# EAGLE schematic homecontroller_anschlussplan (EAGLE 6.6.0)
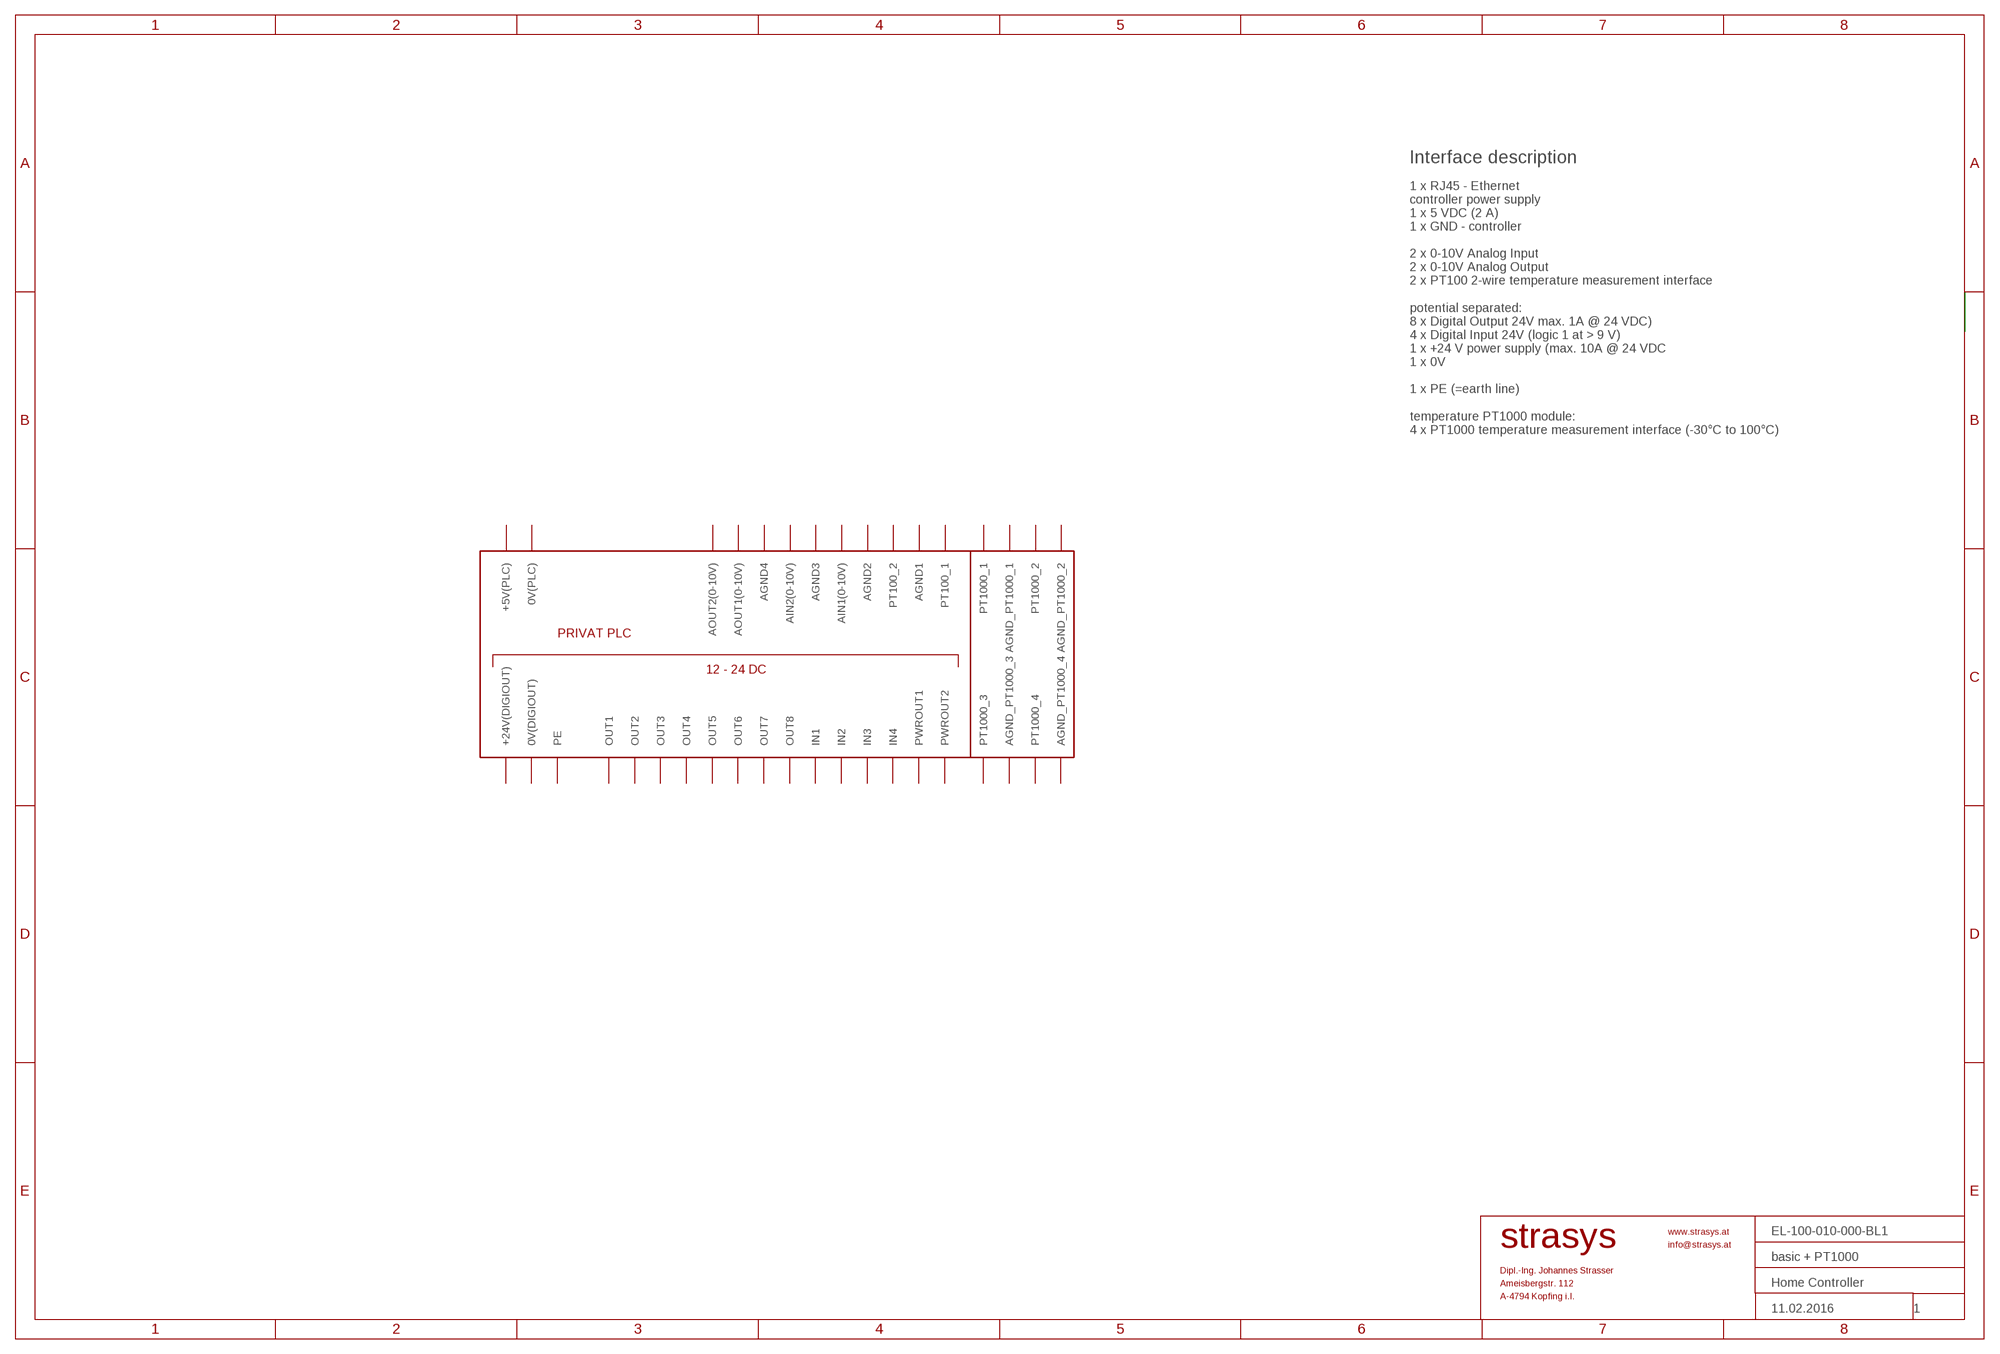
[diagram p0: schematic, sheet 1]
FRAME1 (A3L-LOC): DATE_DRAWING: 11.02.2016; DRAWING_NAME1: basic + PT1000; DRAWING_NAME2: Home Controller; DRAWING_NO: EL-100-010-000-BL1; PAGE: 1

## Parts
U$1  PRIVATEPLC  [PRIVATEPLC]
Unconnected: U$1.AGND1 U$1.AGND2 U$1.AGND3 U$1.AGND4 U$1.AGND_PT1000_1 U$1.AGND_PT1000_2 U$1.AGND_PT1000_3 U$1.AGND_PT1000_4 U$1.AIN1(AIN1(0-10V)) U$1.AIN2(AIN2(0-10V)) U$1.AOUT1(AOUT1(0-10V)) U$1.AOUT2(AOUT2(0-10V)) U$1.IN1 U$1.IN2 U$1.IN3 U$1.IN4 U$1.OUT1 U$1.OUT2 U$1.OUT3 U$1.OUT4 U$1.OUT5 U$1.OUT6 U$1.OUT7 U$1.OUT8 U$1.PT100_1 U$1.PT100_2 U$1.PT1000_1 U$1.PT1000_2 U$1.PT1000_3 U$1.PT1000_4

## Notes on the sheet
- Interface description
- 1 x RJ45 - Ethernet
  controller power supply
  1 x 5 VDC (2 A) 
  1 x GND - controller
  
  2 x 0-10V Analog Input
  2 x 0-10V Analog Output
  2 x PT100 2-wire temperature measurement interface
  
  potential separated:
  8 x Digital Output 24V max. 1A @ 24 VDC)
  4 x Digital Input 24V (logic 1 at > 9 V)
  1 x +24 V power supply (max. 10A @ 24 VDC
  1 x 0V 
  
  1 x PE (=earth line)
  
  temperature PT1000 module:
  4 x PT1000 temperature measurement interface (-30°C to 100°C)

## Power pins joined to a net without a drawn wire
0V(DIGIOUT): U$1.0V(0V(DIGIOUT))
0V(PLC): U$1.P0V(0V(PLC))
+5V(PLC): U$1.P5V(+5V(PLC))
+24V(DIGIOUT): U$1.+24V(+24V(DIGIOUT))
PE: U$1.PE
PWROUT1: U$1.PWROUT1
PWROUT2: U$1.PWROUT2

## Library data of the parts
U$1 = STRASYS_CONTRL:PRIVATEPLC: PRIVATE PLC (Strasys.at) Internet Steuerung 8 x Digital Output, 4 x Digital Input, 2 x PT100, 2 x Analog Out (0-10V), 2 x Analgo IN (0-10V), 2 x Analog OUT (0-10V), 4 x PT1000